# EAGLE design gameboyzero (EAGLE 8.3.2)
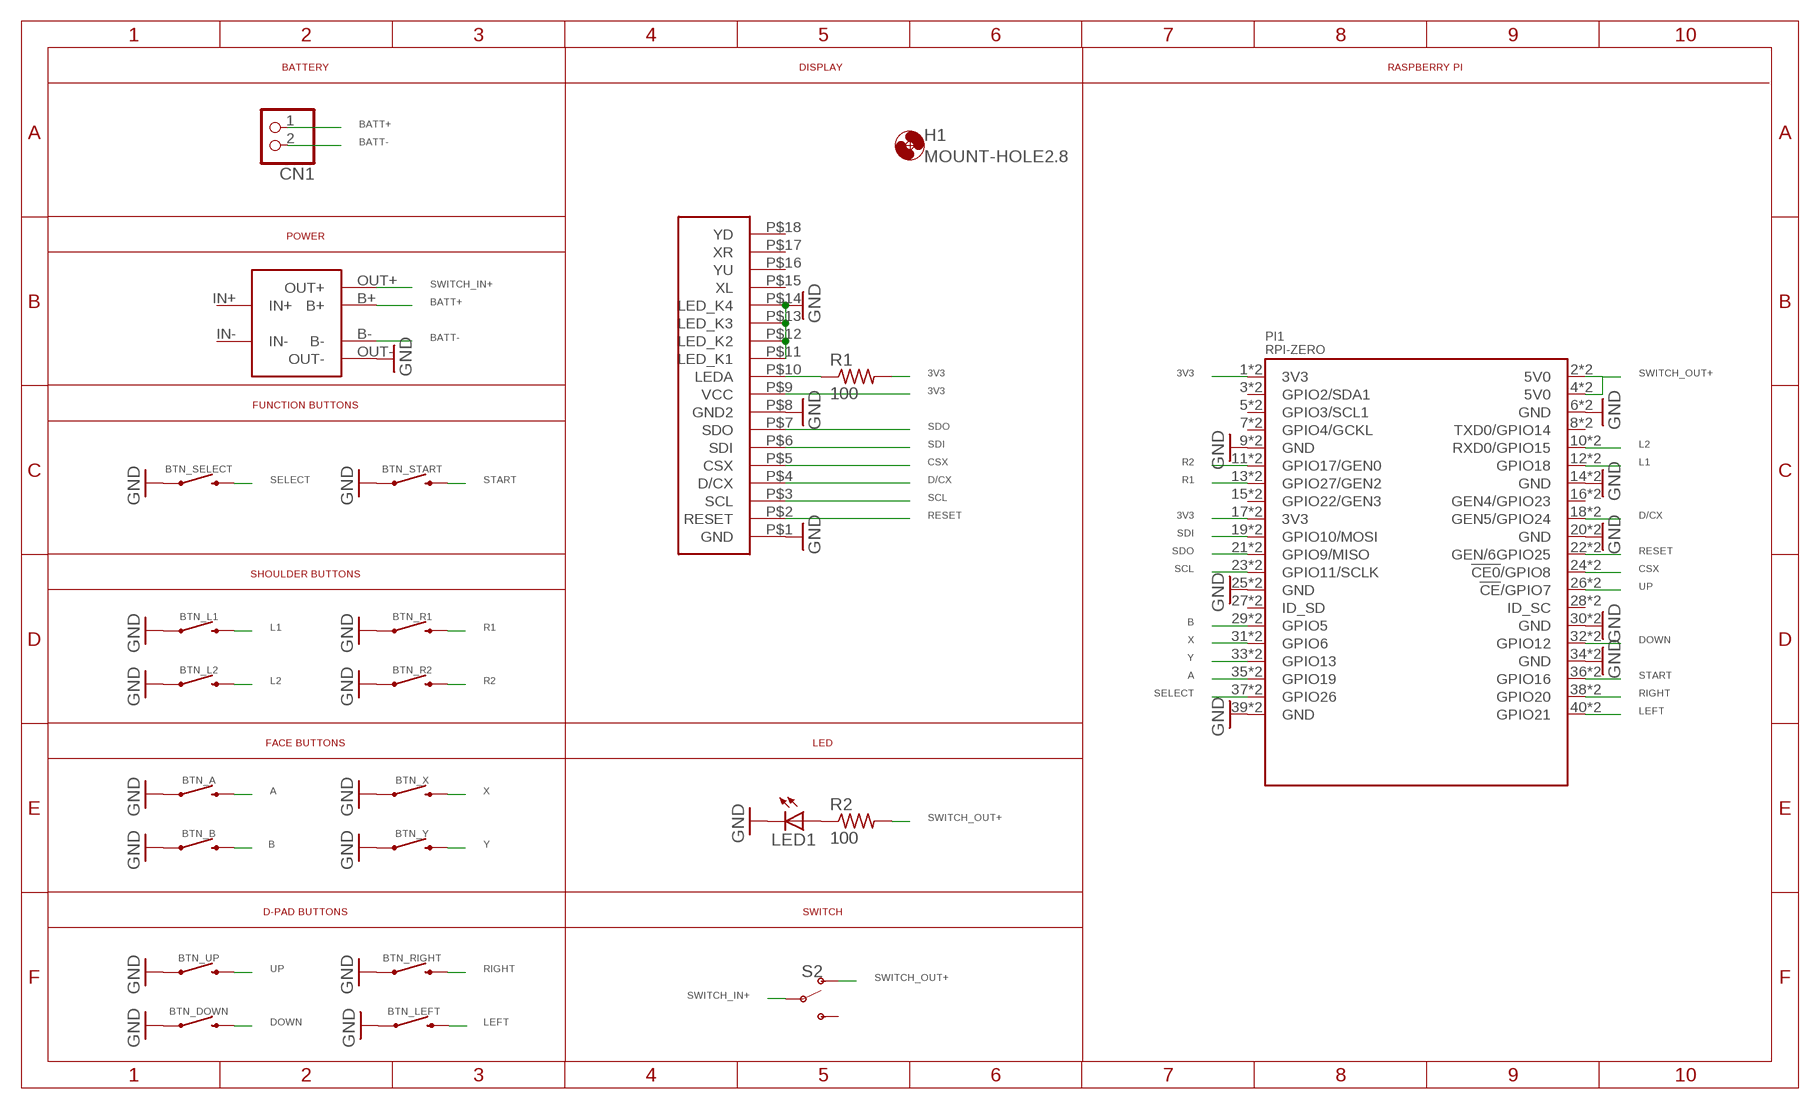
[diagram p0: schematic, sheet 1]

## Parts
BTN_A  MOMENTARY-SWITCH-SPST-SMD-12MM  [TACTILE_SWITCH_SMD_12MM]
BTN_B  MOMENTARY-SWITCH-SPST-SMD-12MM  [TACTILE_SWITCH_SMD_12MM]
BTN_DOWN  MOMENTARY-SWITCH-SPST-SMD-6.2MM-TALL  [TACTILE_SWITCH_SMD_6.2MM_TALL]
BTN_L1  MOMENTARY-SWITCH-SPST-SMD-12MM  [TACTILE_SWITCH_SMD_12MM]
BTN_L2  MOMENTARY-SWITCH-SPST-SMD-12MM  [TACTILE_SWITCH_SMD_12MM]
BTN_LEFT  MOMENTARY-SWITCH-SPST-SMD-6.2MM-TALL  [TACTILE_SWITCH_SMD_6.2MM_TALL]
BTN_R1  MOMENTARY-SWITCH-SPST-SMD-12MM  [TACTILE_SWITCH_SMD_12MM]
BTN_R2  MOMENTARY-SWITCH-SPST-SMD-12MM  [TACTILE_SWITCH_SMD_12MM]
BTN_RIGHT  MOMENTARY-SWITCH-SPST-SMD-6.2MM-TALL  [TACTILE_SWITCH_SMD_6.2MM_TALL]
BTN_SELECT  MOMENTARY-SWITCH-SPST-SMD-6.0X3.5MM  [TACTILE_SWITCH_SMD_6.0X3.5MM]
BTN_START  MOMENTARY-SWITCH-SPST-SMD-6.0X3.5MM  [TACTILE_SWITCH_SMD_6.0X3.5MM]
BTN_UP  MOMENTARY-SWITCH-SPST-SMD-6.2MM-TALL  [TACTILE_SWITCH_SMD_6.2MM_TALL]
BTN_X  MOMENTARY-SWITCH-SPST-SMD-12MM  [TACTILE_SWITCH_SMD_12MM]
BTN_Y  MOMENTARY-SWITCH-SPST-SMD-12MM  [TACTILE_SWITCH_SMD_12MM]
CN1  JST_2PIN-SMT  [JST-PH-2-SMT]
H1  MOUNT-HOLE2.8  [2,8]
LED1  LEDCHIPLED_0805  [CHIPLED_0805]
PI1  RPI-ZERO  [RASPBERRYPI_BASTELSTUBE_V13_RASPI_BOARD_B+_FULL]
POWER1  03962A  [03962A]
R1  100  R-US_R0805  [R0805]
R2  100  R-US_R0805  [R0805]
S2  SWITCH-SPDT-SMD-RIGHT-ANGLE  [SWITCH_SPST_SMD_A]
SCREEN1  GAMEBOYZEROHANDHELDDISPLAYS-2.8  [GAMEBOYZEROHANDHELDDISPLAYS-2.8]

## Nets
3V3: PI1.1(3V3) PI1.17(3V3) PI1.41(3V3) PI1.57(3V3) R1.2 SCREEN1.P$9(VCC)
3V3100OHM: R1.1 SCREEN1.P$10(LEDA)
A: BTN_A.3 PI1.35(GPIO19) PI1.75(GPIO19)
B: BTN_B.3 PI1.29(GPIO5) PI1.69(GPIO5)
BATT+: CN1.1 POWER1.B+
BATT-: CN1.2 POWER1.B-
CSX: PI1.24(!CE0!/GPIO8) PI1.64(!CE0!/GPIO8) SCREEN1.P$5(CSX)
D/CX: PI1.18(GEN5/GPIO24) PI1.58(GEN5/GPIO24) SCREEN1.P$4(D/CX)
DOWN: BTN_DOWN.B2 PI1.32(GPIO12) PI1.72(GPIO12)
GND: BTN_A.1 BTN_B.1 BTN_DOWN.A2 BTN_L1.1 BTN_L2.1 BTN_LEFT.A2 BTN_R1.1 BTN_R2.1 BTN_RIGHT.A2 BTN_SELECT.1 BTN_START.1 BTN_UP.A2 BTN_X.1 BTN_Y.1 LED1.C PI1.6(GND) PI1.9(GND) PI1.14(GND) PI1.20(GND) PI1.25(GND) PI1.30(GND) PI1.34(GND) PI1.39(GND) PI1.46(GND) PI1.49(GND) PI1.54(GND) PI1.60(GND) PI1.65(GND) PI1.70(GND) PI1.74(GND) PI1.79(GND) POWER1.OUT- SCREEN1.P$1(GND) SCREEN1.P$8(GND2) SCREEN1.P$11(LED_K1) SCREEN1.P$12(LED_K2) SCREEN1.P$13(LED_K3) SCREEN1.P$14(LED_K4)
L1: BTN_L1.3 PI1.12(GPIO18) PI1.52(GPIO18)
L2: BTN_L2.3 PI1.10(RXD0/GPIO15) PI1.50(RXD0/GPIO15)
LED: LED1.A R2.1
LEFT: BTN_LEFT.B2 PI1.40(GPIO21) PI1.80(GPIO21)
R1: BTN_R1.3 PI1.13(GPIO27/GEN2) PI1.53(GPIO27/GEN2)
R2: BTN_R2.3 PI1.11(GPIO17/GEN0) PI1.51(GPIO17/GEN0)
RESET: PI1.22(GEN/6GPIO25) PI1.62(GEN/6GPIO25) SCREEN1.P$2(RESET)
RIGHT: BTN_RIGHT.B2 PI1.38(GPIO20) PI1.78(GPIO20)
SCL: PI1.23(GPIO11/SCLK) PI1.63(GPIO11/SCLK) SCREEN1.P$3(SCL)
SDI: PI1.19(GPIO10/MOSI) PI1.59(GPIO10/MOSI) SCREEN1.P$6(SDI)
SDO: PI1.21(GPIO9/MISO) PI1.61(GPIO9/MISO) SCREEN1.P$7(SDO)
SELECT: BTN_SELECT.2 PI1.37(GPIO26) PI1.77(GPIO26)
START: BTN_START.2 PI1.36(GPIO16) PI1.76(GPIO16)
SWITCH_IN+: POWER1.OUT+ S2.2(P)
SWITCH_OUT+: PI1.2(5V0) PI1.4(5V0) PI1.42(5V0) PI1.44(5V0) R2.2 S2.1(O)
UP: BTN_UP.B2 PI1.26(!CE!/GPIO7) PI1.66(!CE!/GPIO7)
X: BTN_X.3 PI1.31(GPIO6) PI1.71(GPIO6)
Y: BTN_Y.3 PI1.33(GPIO13) PI1.73(GPIO13)
Unconnected: PI1.3(GPIO2/SDA1) PI1.5(GPIO3/SCL1) PI1.7(GPIO4/GCKL) PI1.8(TXD0/GPIO14) PI1.15(GPIO22/GEN3) PI1.16(GEN4/GPIO23) PI1.27(ID_SD) PI1.28(ID_SC) PI1.43(GPIO2/SDA1) PI1.45(GPIO3/SCL1) PI1.47(GPIO4/GCKL) PI1.48(TXD0/GPIO14) PI1.55(GPIO22/GEN3) PI1.56(GEN4/GPIO23) PI1.67(ID_SD) PI1.68(ID_SC) POWER1.IN+ POWER1.IN- S2.3(S) SCREEN1.P$15(XL) SCREEN1.P$16(YU) SCREEN1.P$17(XR) SCREEN1.P$18(YD)

## Notes on the sheet
- BATTERY | DISPLAY | RASPBERRY PI
- POWER
- FUNCTION BUTTONS
- SHOULDER BUTTONS
- FACE BUTTONS | LED
- D-PAD BUTTONS | SWITCH

## Library data of the parts
BTN_A BTN_B BTN_L1 BTN_L2 BTN_R1 BTN_R2 BTN_X BTN_Y = SparkFun-Switches:MOMENTARY-SWITCH-SPST: Momentary Switch (Pushbutton) - SPST Normally-open (NO) SPST momentary switches (buttons, pushbuttons). Variants PTH-12MM - 12mm square, through-hole Momentary Pushbutton Switch - 12mm Square <https://www.sparkfun.com/products/9190> (COM-09190) PTH-6.0MM, PTH-6.0MM-KIT - 6.0mm square, through-hole Mini Pushbutton Switch <https://www.sparkfun.com/products/97> (COM-00097) KIT package intended for soldering kit's - only one side of pads' copper is exposed. PTH-RIGHT-ANGLE-KIT - Right-angle, through-hole Right Angle Tactile Button <https://www.sparkfun.com/products/10791> - Used on SparkFun BigTime Watch Kit <https://www.sparkfun.com/products/11734> SMD-12MM - 12mm square, surface-mount Tactile Button - SMD (12mm) <https://www.sparkfun.com/products/12993> (COM-12993) Used on SparkFun PicoBoard <https://www.sparkfun.com/products/11888> SMD-4.5MM - 4.5mm Square Trackball Switch Used on SparkFun Blackberry Trackballer Breakout <https://www.sparkfun.com/products/13169> SMD-4.6MMX2.8MM - 4.60mm x 2.80mm, surface mount Used on SparkFun SAMD21 Mini Breakout <https://www.sparkfun.com/products/13664> SMD-5.2MM, SMD-5.2-REDUNDANT - 5.2mm square, surface-mount Mini Pushbutton Switch - SMD <https://www.sparkfun.com/products/8720> (COM-08720) Used on Arduino Pro Mini <https://www.sparkfun.com/products/11114> REDUNDANT package connects both switch circuits together SMD-6.0X3.5MM - 6.0 x 3.5mm, surface mount Momentary Reset Switch SMD <https://www.sparkfun.com/products/8229> (COM-08229) SMD-6.2MM-TALL - 6.2mm square, surface mount Tactile Button - SMD (6mm) <https://www.sparkfun.com/products/12992> Used on SparkFun Digital Sandbox <https://www.sparkfun.com/products/12651> SMD-RIGHT-ANGLE - Right-angle, surface mount Used on SparkFun Block for Intel® Edison - Arduino <https://www.sparkfun.com/products/13036>; PROD_ID: SWCH-11967; SF_SKU: COM-12993
BTN_DOWN BTN_LEFT BTN_RIGHT BTN_UP = SparkFun-Switches:MOMENTARY-SWITCH-SPST: Momentary Switch (Pushbutton) - SPST Normally-open (NO) SPST momentary switches (buttons, pushbuttons). Variants PTH-12MM - 12mm square, through-hole Momentary Pushbutton Switch - 12mm Square <https://www.sparkfun.com/products/9190> (COM-09190) PTH-6.0MM, PTH-6.0MM-KIT - 6.0mm square, through-hole Mini Pushbutton Switch <https://www.sparkfun.com/products/97> (COM-00097) KIT package intended for soldering kit's - only one side of pads' copper is exposed. PTH-RIGHT-ANGLE-KIT - Right-angle, through-hole Right Angle Tactile Button <https://www.sparkfun.com/products/10791> - Used on SparkFun BigTime Watch Kit <https://www.sparkfun.com/products/11734> SMD-12MM - 12mm square, surface-mount Tactile Button - SMD (12mm) <https://www.sparkfun.com/products/12993> (COM-12993) Used on SparkFun PicoBoard <https://www.sparkfun.com/products/11888> SMD-4.5MM - 4.5mm Square Trackball Switch Used on SparkFun Blackberry Trackballer Breakout <https://www.sparkfun.com/products/13169> SMD-4.6MMX2.8MM - 4.60mm x 2.80mm, surface mount Used on SparkFun SAMD21 Mini Breakout <https://www.sparkfun.com/products/13664> SMD-5.2MM, SMD-5.2-REDUNDANT - 5.2mm square, surface-mount Mini Pushbutton Switch - SMD <https://www.sparkfun.com/products/8720> (COM-08720) Used on Arduino Pro Mini <https://www.sparkfun.com/products/11114> REDUNDANT package connects both switch circuits together SMD-6.0X3.5MM - 6.0 x 3.5mm, surface mount Momentary Reset Switch SMD <https://www.sparkfun.com/products/8229> (COM-08229) SMD-6.2MM-TALL - 6.2mm square, surface mount Tactile Button - SMD (6mm) <https://www.sparkfun.com/products/12992> Used on SparkFun Digital Sandbox <https://www.sparkfun.com/products/12651> SMD-RIGHT-ANGLE - Right-angle, surface mount Used on SparkFun Block for Intel® Edison - Arduino <https://www.sparkfun.com/products/13036>; PROD_ID: SWCH-11966; SF_SKU: COM-12992
BTN_SELECT BTN_START = SparkFun-Switches:MOMENTARY-SWITCH-SPST: Momentary Switch (Pushbutton) - SPST Normally-open (NO) SPST momentary switches (buttons, pushbuttons). Variants PTH-12MM - 12mm square, through-hole Momentary Pushbutton Switch - 12mm Square <https://www.sparkfun.com/products/9190> (COM-09190) PTH-6.0MM, PTH-6.0MM-KIT - 6.0mm square, through-hole Mini Pushbutton Switch <https://www.sparkfun.com/products/97> (COM-00097) KIT package intended for soldering kit's - only one side of pads' copper is exposed. PTH-RIGHT-ANGLE-KIT - Right-angle, through-hole Right Angle Tactile Button <https://www.sparkfun.com/products/10791> - Used on SparkFun BigTime Watch Kit <https://www.sparkfun.com/products/11734> SMD-12MM - 12mm square, surface-mount Tactile Button - SMD (12mm) <https://www.sparkfun.com/products/12993> (COM-12993) Used on SparkFun PicoBoard <https://www.sparkfun.com/products/11888> SMD-4.5MM - 4.5mm Square Trackball Switch Used on SparkFun Blackberry Trackballer Breakout <https://www.sparkfun.com/products/13169> SMD-4.6MMX2.8MM - 4.60mm x 2.80mm, surface mount Used on SparkFun SAMD21 Mini Breakout <https://www.sparkfun.com/products/13664> SMD-5.2MM, SMD-5.2-REDUNDANT - 5.2mm square, surface-mount Mini Pushbutton Switch - SMD <https://www.sparkfun.com/products/8720> (COM-08720) Used on Arduino Pro Mini <https://www.sparkfun.com/products/11114> REDUNDANT package connects both switch circuits together SMD-6.0X3.5MM - 6.0 x 3.5mm, surface mount Momentary Reset Switch SMD <https://www.sparkfun.com/products/8229> (COM-08229) SMD-6.2MM-TALL - 6.2mm square, surface mount Tactile Button - SMD (6mm) <https://www.sparkfun.com/products/12992> Used on SparkFun Digital Sandbox <https://www.sparkfun.com/products/12651> SMD-RIGHT-ANGLE - Right-angle, surface mount Used on SparkFun Block for Intel® Edison - Arduino <https://www.sparkfun.com/products/13036>; PROD_ID: SWCH-00815; SF_SKU: COM-08229
CN1 = adafruit:JST_2PIN: JST 2-Pin Connectors of various flavors SMT-RA (S2B-PH-SM4) 4UConnector #17311 SMT (B2B-PH-SM4) THM-RA (S2B-PH) THM (B2B-PH)
H1 = holes:MOUNT-HOLE: MOUNTING HOLE with drill center marker
LED1 = adafruit:LED: LED OSRAM: - CHIPLED LG R971, LG N971, LY N971, LG Q971, LY Q971, LO R971, LY R971 LH N974, LH R974 LS Q976, LO Q976, LY Q976 LO Q996 - Hyper CHIPLED LW Q18S LB Q993, LB Q99A, LB R99A - SideLED LS A670, LO A670, LY A670, LG A670, LP A670 LB A673, LV A673, LT A673, LW A673 LH A674 LY A675 LS A676, LA A676, LO A676, LY A676, LW A676 LS A679, LY A679, LG A679 - Hyper Micro SIDELED® LS Y876, LA Y876, LO Y876, LY Y876 LT Y87S - SmartLED LW L88C, LW L88S LB L89C, LB L89S, LG L890 LS L89K, LO L89K, LY L89K LS L896, LA L896, LO L896, LY L896 - TOPLED LS T670, LO T670, LY T670, LG T670, LP T670 LSG T670, LSP T670, LSY T670, LOP T670, LYG T670 LG T671, LOG T671, LSG T671 LB T673, LV T673, LT T673, LW T673 LH T674 LS T676, LA T676, LO T676, LY T676, LB T676, LH T676, LSB T676, LW T676 LB T67C, LV T67C, LT T67C, LS T67K, LO T67K, LY T67K, LW E67C LS E67B, LA E67B, LO E67B, LY E67B, LB E67C, LV E67C, LT E67C LW T67C LS T679, LY T679, LG T679 LS T770, LO T770, LY T770, LG T770, LP T770 LB T773, LV T773, LT T773, LW T773 LH T774 LS E675, LA E675, LY E675, LS T675 LS T776, LA T776, LO T776, LY T776, LB T776 LHGB T686 LT T68C, LB T68C - Hyper Mini TOPLED® LB M676 - Mini TOPLED Santana® LG M470 LS M47K, LO M47K, LY M47K Source: http://www.osram.convergy.de/
PI1 = RPI-Zero:RPI-ZERO
POWER1 = 03962A:03962A
R1 R2 = adafruit:R-US_: RESISTOR, American symbol
S2 = SparkFun-Switches:SWITCH-SPDT: Single Pole, Double Throw (SPDT) Switch Single-pole, double-throw (SPDT) switch. Variant Overview SMD-AYZ0202 Surface Mount DPDT Switch <https://www.sparkfun.com/products/597> (COM-00597) Used on e.g. LilyPad Arduino USB - ATmega32U4 Board <https://www.sparkfun.com/products/12049> PTH-11.6X4.0MM SPDT Mini Power Switch <https://www.sparkfun.com/products/102> (COM-00102) Used on e.g. SparkFun Simon Says - Through-Hole Soldering Kit <https://www.sparkfun.com/products/10547> (KIT-10547) PTH-11.6X4.0MM-KIT KIT version of SPDT Mini Power Switch - Simplifies soldering by removing tStop of switch pins - only one side can be soldered. PTH-11.6X4.0MM-LOCK LOCK version of SPDT Mini Power Switch - Offset pins hold switch in place for easier soldering. SMD-RIGHT-ANGLE Surface Mount Right Angle Switch <https://www.sparkfun.com/products/10860> (COM-10860) Used on e.g. SparkFun ESP8266 Thing <https://www.sparkfun.com/products/13231>; PROD_ID: SWCH-10651; SF_SKU: COM-10860
SCREEN1 = GameboyZeroHandheldDisplays:GAMEBOYZEROHANDHELDDISPLAYS-2.8

## Board
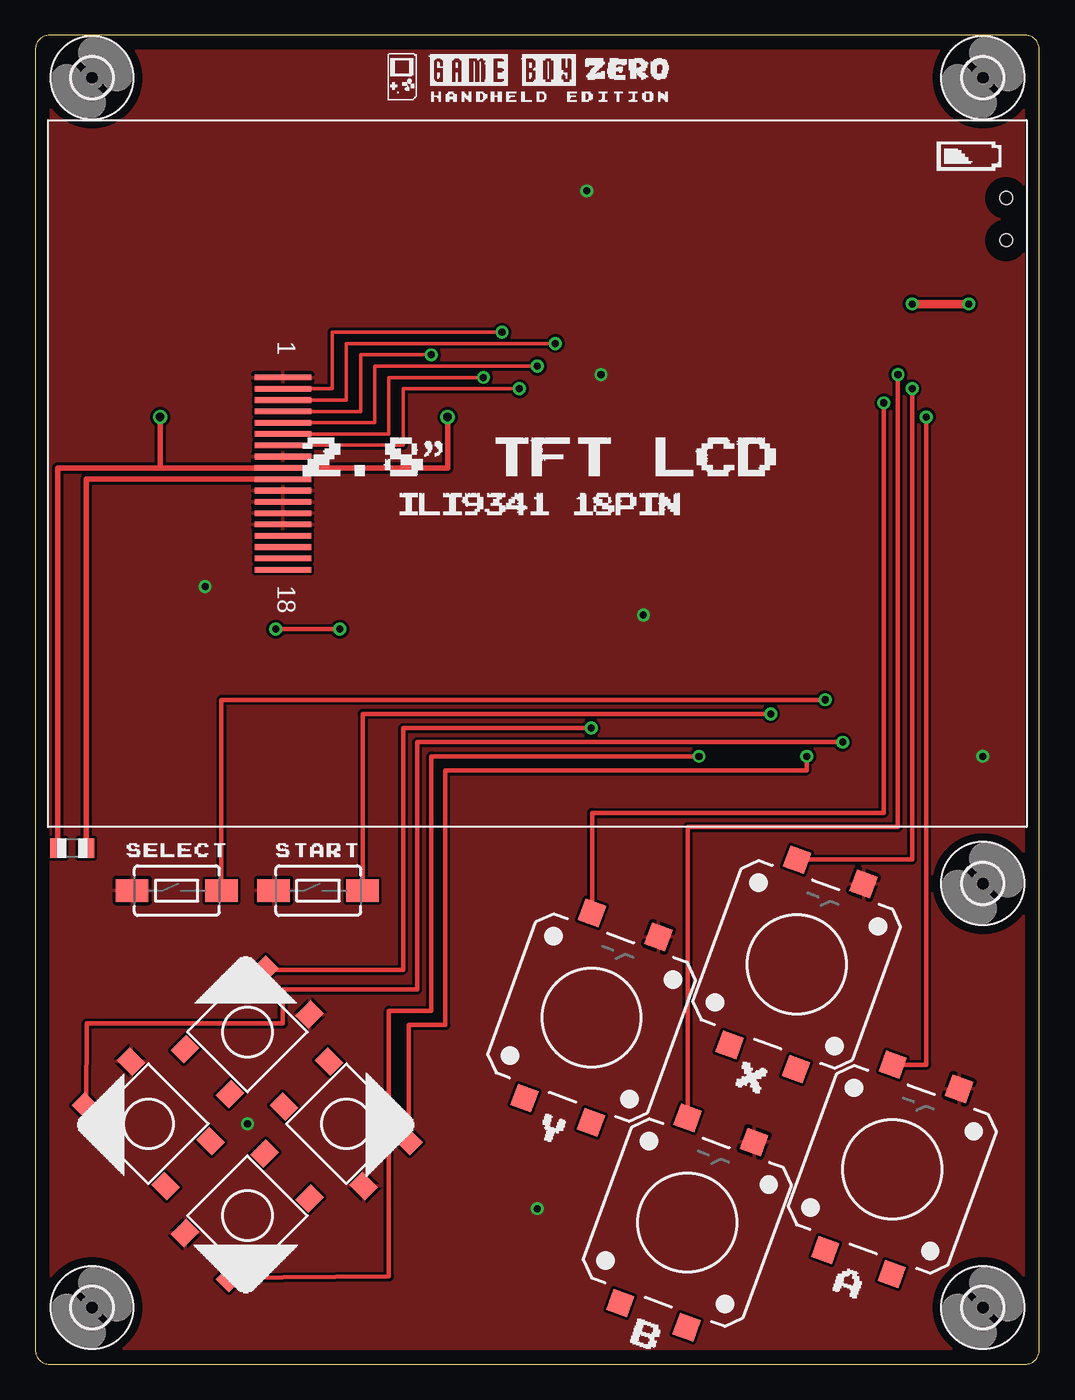
[diagram p1: board, top side]
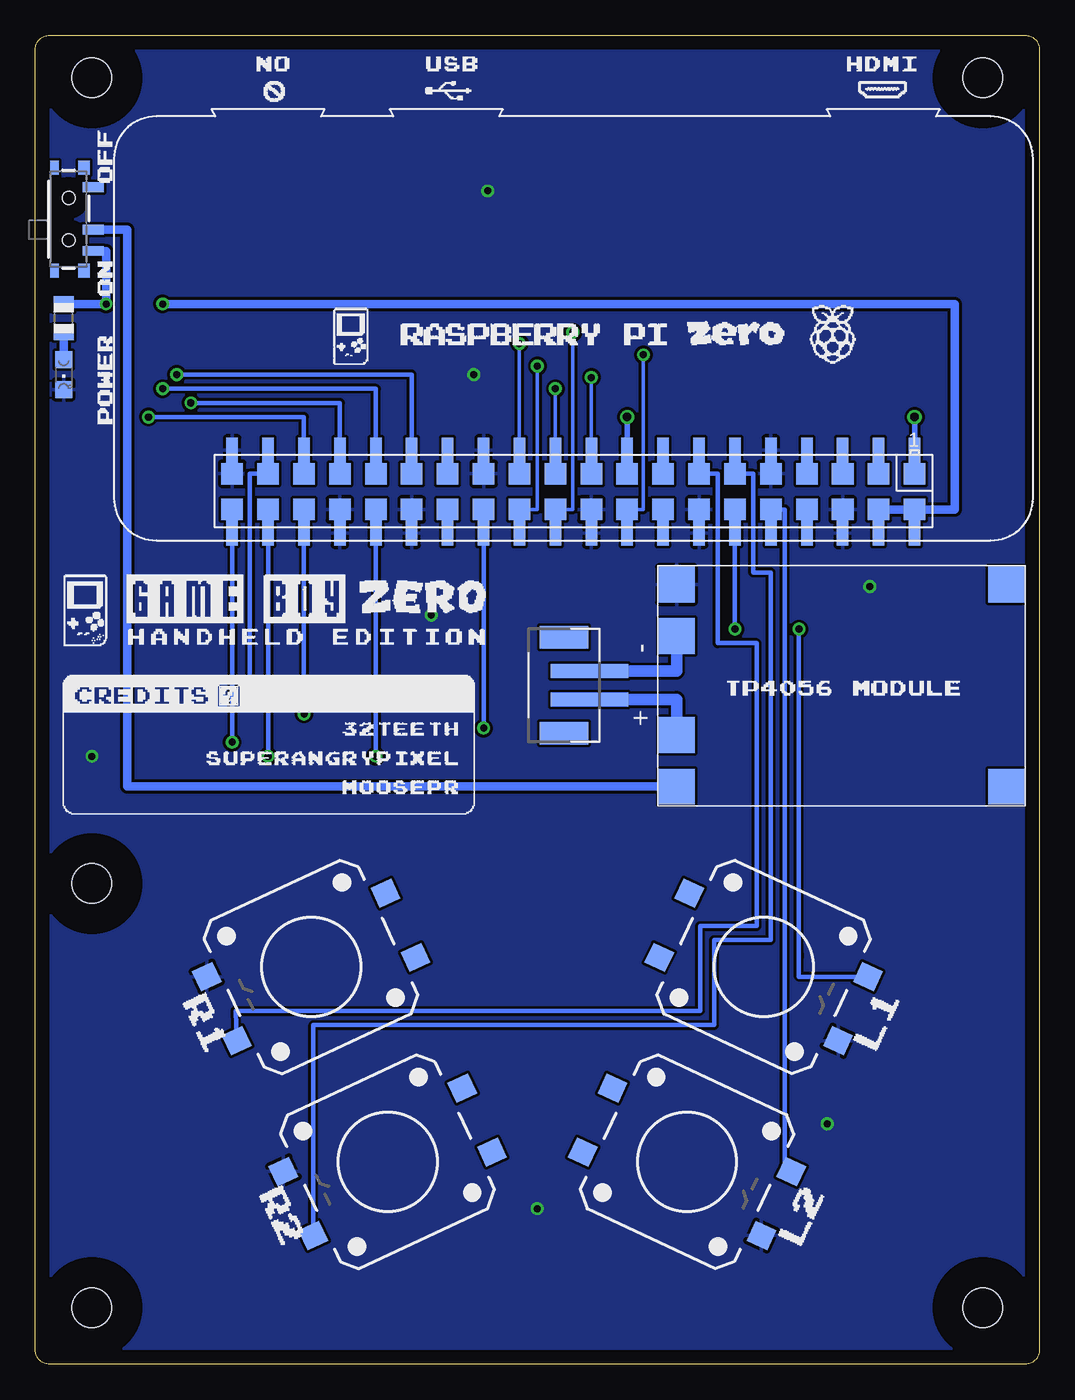
[diagram p2: board, bottom side, seen from below]

Size 71 x 94 mm. Coordinates in mm from the lower left corner, seen from the top.
Outline: 0,93 0,1 arc90 1,0 70,0 arc90 71,1 71,93 arc90 70,94 1,94 arc90 0,93
Copper layers (1*16): Top 0.035mm / dielectric 1.5mm / Bottom 0.035mm
Design rules "default": minimum track width 10mil, minimum drill 24mil, track to track 8mil, track to pad 8mil, pad to pad 8mil, via to via 8mil, smd to smd 8mil, copper to edge 40mil, drill to drill 8mil, minimum pad ring 10mil, minimum via ring 8mil, stop-mask expansion 4mil, vias tented up to drill 0mil, thermal gap 10mil

### Footprints (pad centres in the part's own frame; a part is rotated, then mirrored left to right if it is on the bottom)
TACTILE_SWITCH_SMD_12MM = smd 1.6 x 1.55: 1 6.975,-2.5; 2 -6.975,-2.5; 3 6.975,2.5; 4 -6.975,2.5
TACTILE_SWITCH_SMD_6.2MM_TALL = smd 1.55 x 1.3: A1 -3.975,-2.25; A2 3.975,-2.25; B1 -3.975,2.25; B2 3.975,2.25
TACTILE_SWITCH_SMD_6.0X3.5MM = smd 2.3 x 1.6: 1 -3.15,0; 2 3.15,0
JST-PH-2-SMT = smd 1 x 5.5: 1 -1,-1.8; 2 1,-1.8 | smd 1.6 x 3.4: NC1 -3.4,0; NC2 3.4,0
2,8 = hole 2.8: 0,0
CHIPLED_0805 = smd 1.2 x 1.2: A 0,-1.05; C 0,1.05
RASPBERRYPI_BASTELSTUBE_V13_RASPI_BOARD_B+_FULL = smd 1.524 x 1.524: 1 8.382,25.273; 2 8.382,27.813; 3 10.922,25.273; 4 10.922,27.813; 5 13.462,25.273; 6 13.462,27.813; 7 16.002,25.273; 8 16.002,27.813; 9 18.542,25.273; 10 18.542,27.813; 11 21.082,25.273; 12 21.082,27.813; 13 23.622,25.273; 14 23.622,27.813; 15 26.162,25.273; 16 26.162,27.813; 17 28.702,25.273; 18 28.702,27.813; 19 31.242,25.273; 20 31.242,27.813; 21 33.782,25.273; 22 33.782,27.813; 23 36.322,25.273; 24 36.322,27.813; 25 38.862,25.273; 26 38.862,27.813; 27 41.402,25.273; 28 41.402,27.813; 29 43.942,25.273; 30 43.942,27.813; 31 46.482,25.273; 32 46.482,27.813; 33 49.022,25.273; 34 49.022,27.813; 35 51.562,25.273; 36 51.562,27.813; 37 54.102,25.273; 38 54.102,27.813; 39 56.642,25.273; 40 56.642,27.813 | smd 0.813 x 1.778: 41 8.382,23.622; 42 8.382,29.464; 43 10.922,23.622; 44 10.922,29.464; 45 13.462,23.622; 46 13.462,29.464; 47 16.002,23.622; 48 16.002,29.464; 49 18.542,23.622; 50 18.542,29.464; 51 21.082,23.622; 52 21.082,29.464; 53 23.622,23.622; 54 23.622,29.464; 55 26.162,23.622; 56 26.162,29.464; 57 28.702,23.622; 58 28.702,29.464; 59 31.242,23.622; 60 31.242,29.464; 61 33.782,23.622; 62 33.782,29.464; 63 36.322,23.622; 64 36.322,29.464; 65 38.862,23.622; 66 38.862,29.464; 67 41.402,23.622; 68 41.402,29.464; 69 43.942,23.622; 70 43.942,29.464; 71 46.482,23.622; 72 46.482,29.464; 73 49.022,23.622; 74 49.022,29.464; 75 51.562,23.622; 76 51.562,29.464; 77 54.102,23.622; 78 54.102,29.464; 79 56.642,23.622; 80 56.642,29.464
03962A = smd 2.54 x 2.54: B+ 12,1.35; B- 5,1.35; IN+ 15.65,24.65; IN- 1.35,24.65; OUT+ 15.65,1.35; OUT- 1.35,1.35
R0805 = smd 1.1 x 1.4: 1 -1,0; 2 1,0
SWITCH_SPST_SMD_A = smd 0.7 x 1.5: 1 -2.25,-1.75; 2 -0.75,-1.75; 3 2.25,-1.75 | smd 1 x 0.6: GND1 -3.65,1; GND3 3.65,1 | smd 1 x 0.8: GND2 -3.65,-1.1; GND4 3.65,-1.1 | hole 0.9: -1.5,0; 1.5,0
GAMEBOYZEROHANDHELDDISPLAYS-2.8 = smd 4 x 0.4: P$1 -18,6.8; P$2 -18,6; P$3 -18,5.2; P$4 -18,4.4; P$5 -18,3.6; P$6 -18,2.8; P$7 -18,2; P$8 -18,1.2; P$9 -18,0.4; P$10 -18,-0.4; P$11 -18,-1.2; P$12 -18,-2; P$13 -18,-2.8; P$14 -18,-3.6; P$15 -18,-4.4; P$16 -18,-5.2; P$17 -18,-6; P$18 -18,-6.8

### Placement (x,y rotation side)
BTN_A  60.59,13.78 70 top
BTN_B  46.09,10.02 70 top
BTN_DOWN  15,10.5 225 top
BTN_L1  19.5,28.09 335 bottom
BTN_L2  24.92,14.31 335 bottom
BTN_LEFT  8,17 135 top
BTN_R1  51.5,28.09 205 bottom
BTN_R2  46.08,14.31 205 bottom
BTN_RIGHT  22,17 315 top
BTN_SELECT  10,33.5 0 top
BTN_START  20,33.5 0 top
BTN_UP  15,23.5 45 top
BTN_X  53.83,28.28 70 top
BTN_Y  39.33,24.52 70 top
CN1  33.62,48.02 90 bottom
H1  4,4 0 top
H2  MOUNT-HOLE2.8  [2,8]  67,4 0 top
H3  MOUNT-HOLE2.8  [2,8]  67,34 0 top
H4  MOUNT-HOLE2.8  [2,8]  4,91 0 top
H5  MOUNT-HOLE2.8  [2,8]  67,91 0 top
LED1  69,70 180 bottom
PI1  0.45,88.27 180 bottom
POWER1  27,56.5 270 bottom
R1  2.6,36.5 180 top
R2  69,74 90 bottom
S2  68.65,81 90 bottom
SCREEN1  35.5,63 0 top

### Tracks (layer width: path | path; a pad name or v marks a point on that pad's centre or on a via)
3V3  (via drill 0.6)
  Top 0.406: R1.2 1.6,63.4 8.83,63.4 | 8.83,63.4 v8.83,67 | v29.15,67 29.15,63.4 SCREEN1.P$9 8.83,63.4
  Bottom 0.406: v8.83,67 PI1.41 PI1.1 | v29.15,67 PI1.57 PI1.17
3V3100OHM
  Top 0.406: R1.1 3.6,62.6 SCREEN1.P$10
A  (via drill 0.5)
  Top 0.305: BTN_A.3 63,21.19 v63,67
  Bottom 0.254: PI1.75 PI1.35
  Bottom 0.305: PI1.35 52.01,67 v63,67
B  (via drill 0.5)
  Top 0.305: BTN_B.3 46.13,38 61,38 v61,70
  Bottom 0.254: PI1.69 PI1.29
  Bottom 0.305: PI1.29 44.39,70 v61,70
BATT+
  Bottom 0.813: CN1.1 25.65,47.02 POWER1.B+
BATT-
  Bottom 0.813: POWER1.B- 25.65,49.02 CN1.2
CSX  (via drill 0.5)
  Top 0.254: v35.5,70.6 24,70.6 24,66.6 SCREEN1.P$5
  Bottom 0.254: v35.5,70.6 35.5,60.46 PI1.24 PI1.64
D/CX  (via drill 0.5)
  Top 0.254: v28,71.4 23,71.4 23,67.4 SCREEN1.P$4
  Bottom 0.254: v28,71.4 28,60.46 PI1.18 PI1.58
DOWN  (via drill 0.5)
  Top 0.305: BTN_DOWN.B2 25,6.2 25,25 28,25 28,43 v46.93,43
  Bottom 0.254: PI1.32 46.93,59
  Bottom 0.305: 46.93,59 v46.93,43
  Bottom 0.406: PI1.72 46.93,59
GND  (via drill 0.5)
  other vias: 12,55 39,83 40,70 43,53 67,43 35.5,11 15,17
  pour Bottom: 0,0 0,94 71,94 71,0
  pour Top: 71,94 71,0 0,0 0,94
L1  (via drill 0.5)
  Top 0.305: v17,52 v21.53,52
  Bottom 0.254: PI1.12 21.53,59
  Bottom 0.305: 17,29 17,28.78 | 17,29 v17,52 | 21.53,59 v21.53,52 | BTN_L1.3 17,27.41 17,29
  Bottom 0.406: PI1.52 21.53,59
L2
  Bottom 0.305: PI1.10 18,60.46 18,13.63 BTN_L2.3
  Bottom 0.406: PI1.10 PI1.50
LED
  Bottom 0.61: LED1.A R2.1
LEFT  (via drill 0.5)
  Top 0.305: BTN_LEFT.B2 3.62,24.1 17.5,24.1 17.5,26.5 27,26.5 27,44 v57.09,44
  Bottom 0.254: PI1.40 57.09,59
  Bottom 0.305: 57.09,59 v57.09,44
  Bottom 0.406: PI1.80 57.09,59
R1
  Bottom 0.254: PI1.13 PI1.53
  Bottom 0.305: BTN_R1.3 56.84,25 24,25 24,31 20,31 20,51 22.75,51 22.75,63 PI1.13
R2
  Bottom 0.254: PI1.11 PI1.51
  Bottom 0.305: BTN_R2.3 51.35,24 23,24 23,30 19,30 19,56 20.25,56 20.25,63 PI1.11
RESET  (via drill 0.5)
  Top 0.254: v33,73 21,73 21,69 SCREEN1.P$2
  Bottom 0.254: v33,73 33,60.46 PI1.22 PI1.62
RIGHT  (via drill 0.5)
  Top 0.305: BTN_RIGHT.B2 26.4,24 29,24 29,42 54.55,42 v54.55,43
  Bottom 0.254: PI1.38 54.55,59
  Bottom 0.305: 54.55,59 v54.55,43
  Bottom 0.406: PI1.78 54.55,59
SCL  (via drill 0.5)
  Top 0.254: SCREEN1.P$3 22,68.2 22,72.2 v36.77,72.2
  Bottom 0.254: PI1.23 | PI1.23 v36.77,72.2 | PI1.63 PI1.23
SDI  (via drill 0.5)
  Top 0.254: SCREEN1.P$6 25,65.8 25,69.8 v31.69,69.8
  Bottom 0.254: v31.69,69.8 PI1.59 PI1.19
SDO  (via drill 0.5)
  Top 0.254: SCREEN1.P$7 26,65 26,69 v34.23,69
  Bottom 0.254: v34.23,69 PI1.61 PI1.21
SELECT  (via drill 0.5)
  Top 0.305: BTN_SELECT.2 13.15,47 v55.85,47
  Bottom 0.254: PI1.77 PI1.37
  Bottom 0.305: PI1.37 55.85,63 v55.85,47
START  (via drill 0.5)
  Top 0.305: BTN_START.2 23.15,46 v52,46
  Bottom 0.254: PI1.36 52.01,59
  Bottom 0.305: 52.01,59 v52.01,46 v52,46
  Bottom 0.406: PI1.76 52.01,59
SWITCH_IN+
  Bottom 0.61: S2.2 64.5,80.25 64.5,40.85 POWER1.OUT+
SWITCH_OUT+  (via drill 0.5)
  Top 0.61: v62,75 v66,75
  Bottom 0.254: PI1.4 PI1.44 | PI1.2 PI1.42
  Bottom 0.61: R2.2 v66,75 66,78.75 S2.1 | PI1.4 PI1.2 6,60.46 6,75 v62,75
UP  (via drill 0.5)
  Top 0.305: BTN_UP.B2 26,27.9 26,45 v39.31,45
  Bottom 0.254: PI1.26 39.31,59
  Bottom 0.305: 39.31,59 v39.31,45
  Bottom 0.406: PI1.66 39.31,59
X  (via drill 0.5)
  Top 0.305: BTN_X.3 62,35.69 v62,69
  Bottom 0.254: PI1.71 PI1.31
  Bottom 0.305: PI1.31 46.93,69 v62,69
Y  (via drill 0.5)
  Top 0.305: BTN_Y.3 39.37,39 60,39 v60,68
  Bottom 0.254: PI1.73 PI1.33
  Bottom 0.305: PI1.33 49.47,68 v60,68